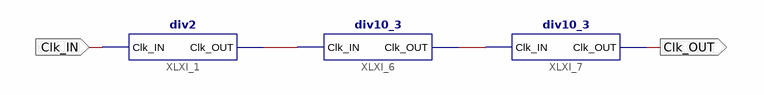
[diagram p0: schematic sheet 1]
// Xilinx ISE schematic ClkFor7Segment.sch (spartan6) as structural Verilog: 3 symbols, 2 ports
module ClkFor7Segment (
  input  Clk_IN,
  output Clk_OUT
);

  wire XLXN_1, XLXN_2;

  div2 XLXI_1 (.Clk_IN(Clk_IN), .Clk_OUT(XLXN_1));
  div10_3 XLXI_6 (.Clk_IN(XLXN_1), .Clk_OUT(XLXN_2));
  div10_3 XLXI_7 (.Clk_IN(XLXN_2), .Clk_OUT(Clk_OUT));
endmodule
